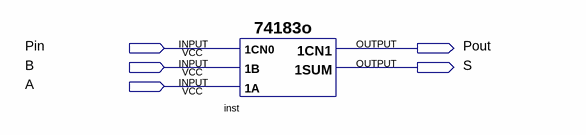
[diagram p0: schematic sheet]
// Quartus schematic 31.bdf as structural Verilog: 1 symbols, 5 pins
module \31  (
  input  Pin,
  input  B,
  input  A,
  output Pout,
  output S
);

  \74183o  inst (.\1CN0 (Pin), .\1A (A), .\1B (B), .\1CN1 (Pout), .\1SUM (S));
endmodule
